# EAGLE schematic helicopter (EAGLE 6.2)
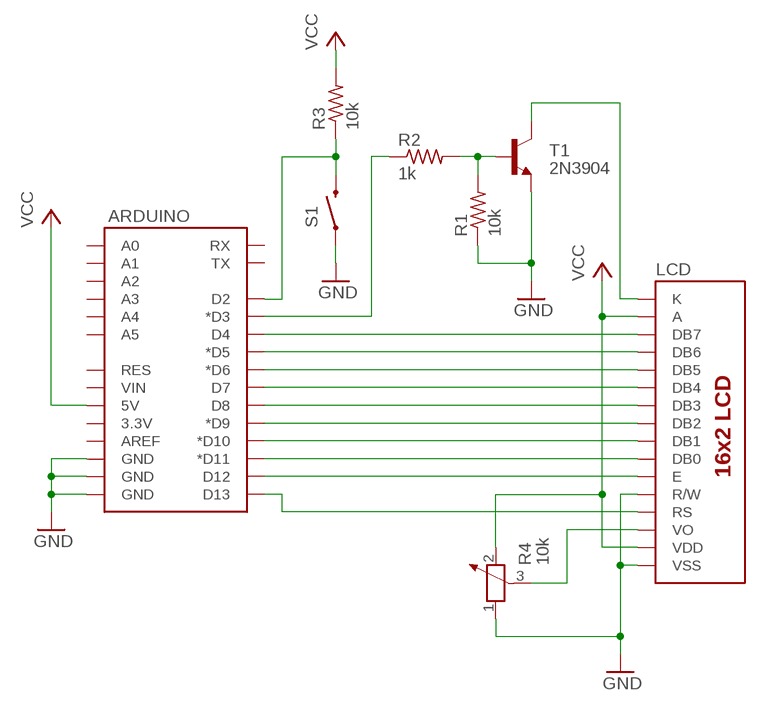
[diagram p0: schematic, sheet 1]

## Parts
ARDUINO  ARDUINO_SHIELDLABEL  [DUEMILANOVE_SHIELD]
LCD  LCD-16X2NOHOLES  [LCD-16X2_NOHOLES]
R1  10k  R-US_0207/10  [0207/10]
R2  1k  R-US_0207/10  [0207/10]
R3  10k  R-US_0207/10  [0207/10]
R4  10k  POTENTIOMETER_PT-10  [PT-10]
S1  SWITCH-MOMENTARY-2PTH  [TACTILE-PTH]
T1  2N3904  [TO92]

## Nets
GND: ARDUINO.GND@0(GND) ARDUINO.GND@1(GND) ARDUINO.GND@2(GND) LCD.1(VSS) LCD.5(R/W) R1.1 R4.1 S1.1 T1.3(E)
N$1: ARDUINO.D12 LCD.6(E)
N$2: ARDUINO.D11(*D11) LCD.7(DB0)
N$3: ARDUINO.D10(*D10) LCD.8(DB1)
N$4: ARDUINO.D9(*D9) LCD.9(DB2)
N$5: ARDUINO.D8 LCD.10(DB3)
N$6: ARDUINO.D7 LCD.11(DB4)
N$7: ARDUINO.D6(*D6) LCD.12(DB5)
N$8: ARDUINO.D5(*D5) LCD.13(DB6)
N$9: ARDUINO.D4 LCD.14(DB7)
N$10: ARDUINO.D13 LCD.4(RS)
N$11: ARDUINO.D2 R3.1 S1.3
N$12: LCD.3(VO) R4.3
N$15: LCD.16(K) T1.1(C)
N$16: R1.2 R2.2 T1.2(B)
N$17: ARDUINO.D3(*D3) R2.1
VCC: ARDUINO.5V LCD.2(VDD) LCD.15(A) R3.2 R4.2
Unconnected: ARDUINO.3.3V ARDUINO.A0 ARDUINO.A1 ARDUINO.A2 ARDUINO.A3 ARDUINO.A4 ARDUINO.A5 ARDUINO.AREF ARDUINO.RES ARDUINO.RX ARDUINO.TX ARDUINO.VIN

## Library data of the parts
ARDUINO = SparkFun-Boards:ARDUINO_SHIELD: Arduino shield footprint
LCD = SparkFun-Displays:LCD-16X2: Standard text-only 16x2 parallel input LCD
R1-R3 = rcl:R-US_: RESISTOR, American symbol
R4 = rcl:POTENTIOMETER_: Potentiometer
S1 = SparkFun-Electromechanical:SWITCH-MOMENTARY-2: Various NO switches- pushbuttons, reed, etc
T1 = transistor:2N3904: NPN TRANSISTOR